# EAGLE design untitled (EAGLE 9.6.2)
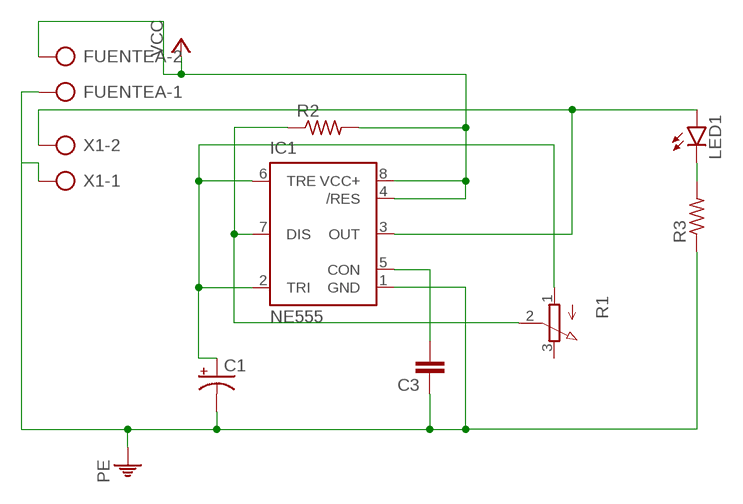
[diagram p0: schematic, sheet 1]

## Parts
C1  CPOL-USE1.8-4  [E1,8-4]
C3  C2,5-3  [C2.5-3]
FUENTEA  AK500/2-H  [AK500/2-H]
IC1  NE555  [DIL-08]
LED1  LED5MM  [LED5MM]
R1  3RP/1610N  [3RP/1610N]
R2  R-US_0204/7  [0204/7]
R3  R-US_0204/7  [0204/7]
X1  AK500/2-H  [AK500/2-H]

## Nets
N$1: IC1.3(OUT) LED1.A X1.2
N$3: C1.+ IC1.2(TRI) IC1.6(TRE) R1.1(A)
N$4: LED1.K(C) R3.2
N$6: C3.2 IC1.5(CON)
N$8: IC1.7(DIS) R1.2(S) R2.1
PE: C1.- C3.1 FUENTEA.1 IC1.1(GND) R3.1 X1.1
VCC: FUENTEA.2 IC1.4(/RES) IC1.8(VCC+) R2.2
Unconnected: R1.3(E)

## Library data of the parts
C1 = rcl:CPOL-US: POLARIZED CAPACITOR, American symbol; SPICEPREFIX: C
C3 = capacitor-wima:C: CAPACITOR naming: grid - package width
FUENTEA X1 = con-ptr500:AK500/2-H: CONNECTOR Aug. 2004 / PTR Meßtechnik: Die Bezeichnung der Serie AK505 wurde geändert. Es handelt sich hierbei um AK500 in horizontaler Ausführung.; OC_FARNELL: unknown; OC_NEWARK: unknown
IC1 = st-microelectronics:NE555: General purpose bipolar Timer; MF: Arrow Electronics; MPN: NE555N; OC_FARNELL: 1467742; OC_NEWARK: 89K1486
LED1 = led:LED: LED OSRAM: - CHIPLED LG R971, LG N971, LY N971, LG Q971, LY Q971, LO R971, LY R971 LH N974, LH R974 LS Q976, LO Q976, LY Q976 LO Q996 - Hyper CHIPLED LW Q18S LB Q993, LB Q99A, LB R99A - SideLED LS A670, LO A670, LY A670, LG A670, LP A670 LB A673, LV A673, LT A673, LW A673 LH A674 LY A675 LS A676, LA A676, LO A676, LY A676, LW A676 LS A679, LY A679, LG A679 - Hyper Micro SIDELED® LS Y876, LA Y876, LO Y876, LY Y876 LT Y87S - SmartLED LW L88C, LW L88S LB L89C, LB L89S, LG L890 LS L89K, LO L89K, LY L89K LS L896, LA L896, LO L896, LY L896 - TOPLED LS T670, LO T670, LY T670, LG T670, LP T670 LSG T670, LSP T670, LSY T670, LOP T670, LYG T670 LG T671, LOG T671, LSG T671 LB T673, LV T673, LT T673, LW T673 LH T674 LS T676, LA T676, LO T676, LY T676, LB T676, LH T676, LSB T676, LW T676 LB T67C, LV T67C, LT T67C, LS T67K, LO T67K, LY T67K, LW E67C LS E67B, LA E67B, LO E67B, LY E67B, LB E67C, LV E67C, LT E67C LW T67C LS T679, LY T679, LG T679 LS T770, LO T770, LY T770, LG T770, LP T770 LB T773, LV T773, LT T773, LW T773 LH T774 LS E675, LA E675, LY E675, LS T675 LS T776, LA T776, LO T776, LY T776, LB T776 LHGB T686 LT T68C, LB T68C - Hyper Mini TOPLED® LB M676 - Mini TOPLED Santana® LG M470 LS M47K, LO M47K, LY M47K Source: http://www.osram.convergy.de LUXEON: - LUMILED® LXK2-PW12-R00, LXK2-PW12-S00, LXK2-PW14-U00, LXK2-PW14-V00 LXK2-PM12-R00, LXK2-PM12-S00, LXK2-PM14-U00 LXK2-PE12-Q00, LXK2-PE12-R00, LXK2-PE12-S00, LXK2-PE14-T00, LXK2-PE14-U00 LXK2-PB12-K00, LXK2-PB12-L00, LXK2-PB12-M00, LXK2-PB14-N00, LXK2-PB14-P00, LXK2-PB14-Q00 LXK2-PR12-L00, LXK2-PR12-M00, LXK2-PR14-Q00, LXK2-PR14-R00 LXK2-PD12-Q00, LXK2-PD12-R00, LXK2-PD12-S00 LXK2-PH12-R00, LXK2-PH12-S00 LXK2-PL12-P00, LXK2-PL12-Q00, LXK2-PL12-R00 Source: www.luxeon.com KINGBRIGHT: KA-3528ASYC Source: www.kingbright.com
R1 = pot:3RP/1610N: 16mm Potentiometer one level Source: http://www.alphapotentiometers.net/html/16mm_pot_2.html
R2 R3 = rcl:R-US_: RESISTOR, American symbol; SPICEPREFIX: R

## Board
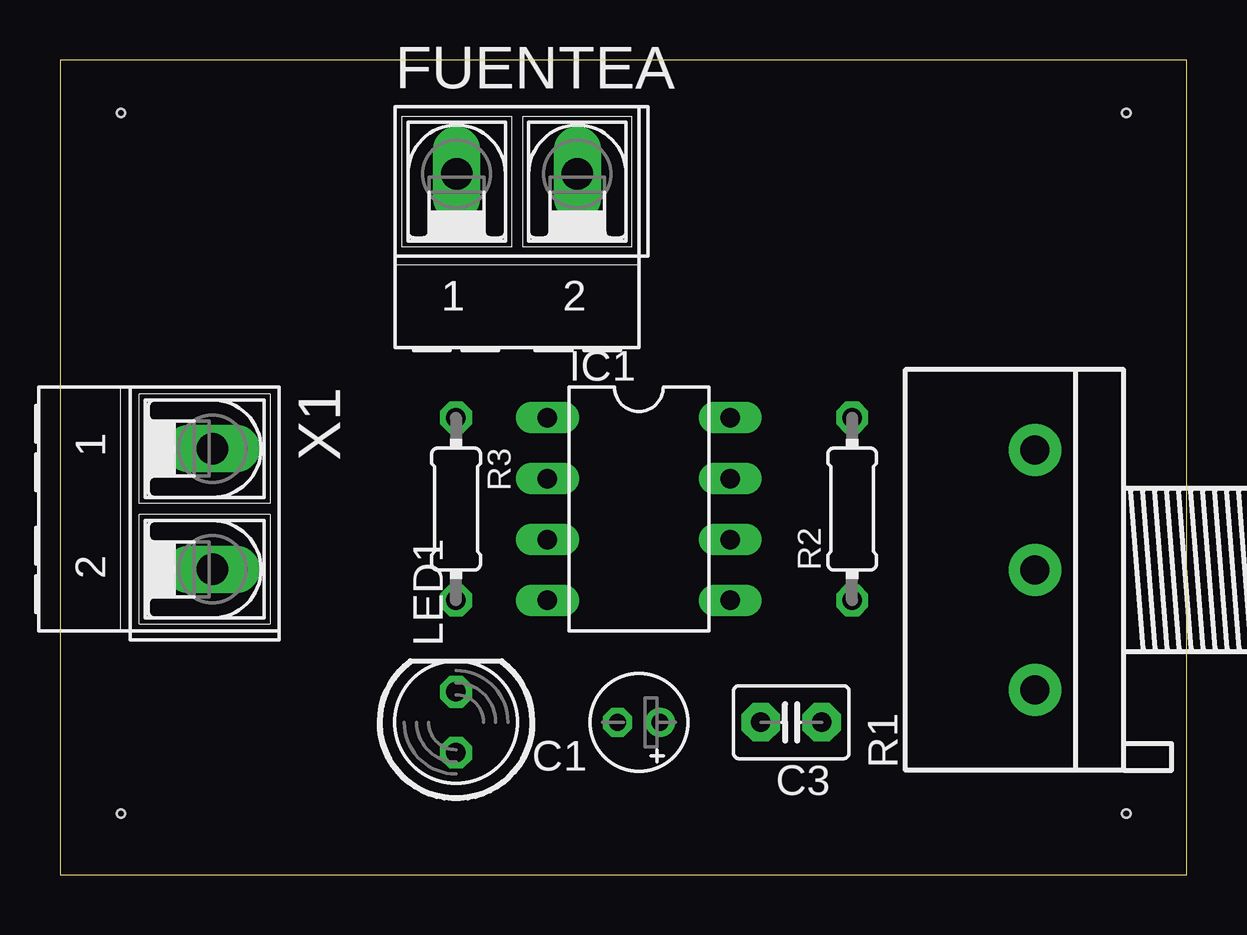
[diagram p1: board, top side]
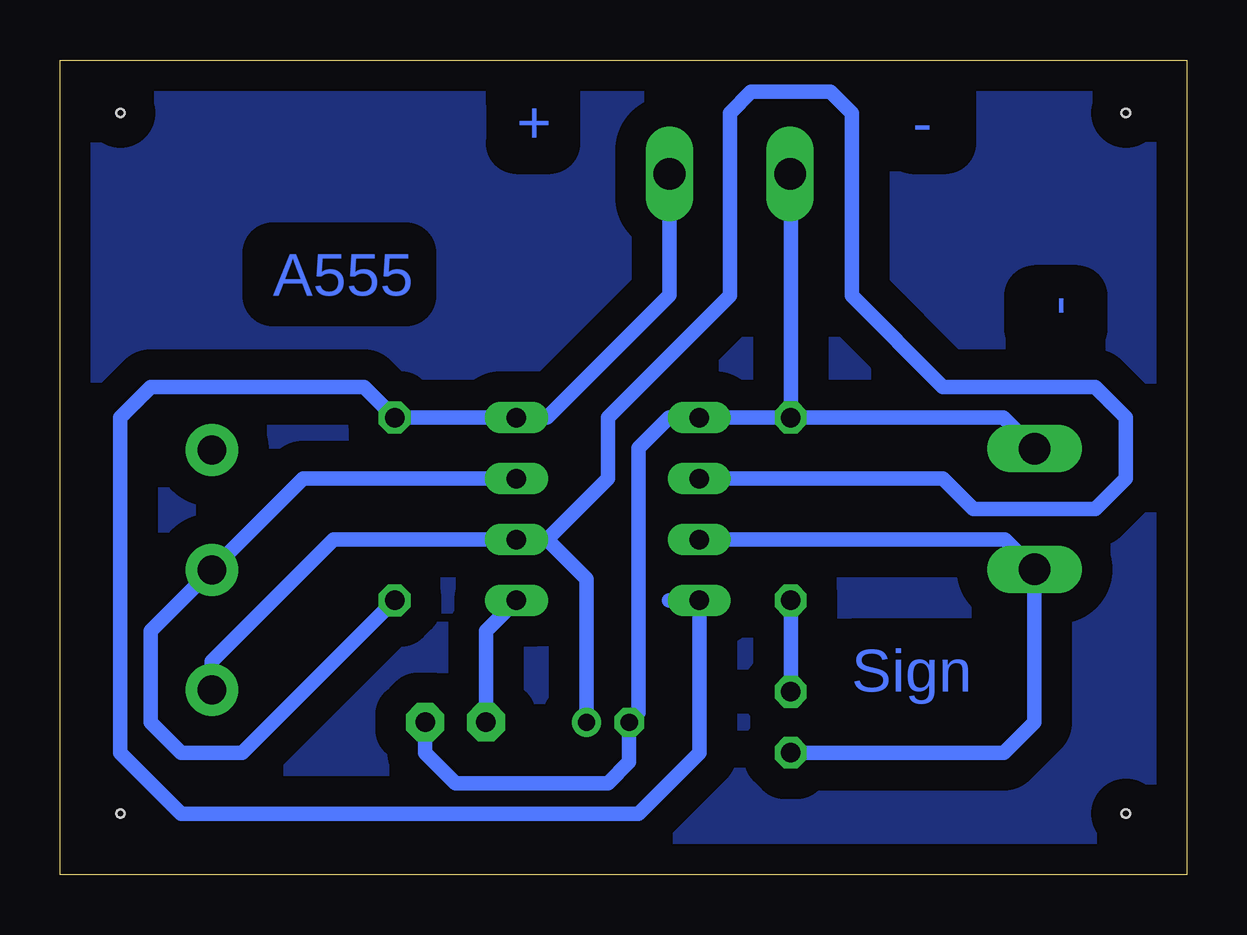
[diagram p2: board, bottom side, seen from below]

Size 46.97 x 33.96 mm. Coordinates in mm from the lower left corner, seen from the top.
Outline: 0,0 46.97,0 46.97,33.96 0,33.96 0,0
Copper layers (1*16): Top 0.035mm / dielectric 1.5mm / Bottom 0.035mm
Design rules "default": minimum track width 6mil, minimum drill 0.35mm, track to track 6mil, track to pad 6mil, pad to pad 6mil, via to via 6mil, smd to smd 6mil, copper to edge 40mil, drill to drill 6mil, minimum pad ring 10mil, minimum via ring 8mil, stop-mask expansion 4mil, vias tented up to drill 0mil, thermal gap 10mil
Holes 0.35 mm at 2.54,31.75 2.54,2.54 44.45,2.54 44.45,31.75

### Footprints (pad centres in the part's own frame; a part is rotated, then mirrored left to right if it is on the bottom)
E1,8-4 = drill 0.711 pad 1.168: + -0.889,0 | drill 0.711 pad 1.168 octagon: - 0.889,0
C2.5-3 = drill 0.813 pad 1.6 octagon: 1 -1.27,0; 2 1.27,0
AK500/2-H = drill 1.321 long: 1 -2.515,0; 2 2.515,0
DIL-08 = drill 0.813 long: 1 -3.81,-3.81; 2 -1.27,-3.81; 3 1.27,-3.81; 4 3.81,-3.81; 5 3.81,3.81; 6 1.27,3.81; 7 -1.27,3.81; 8 -3.81,3.81
LED5MM = drill 0.813 octagon: A -1.27,0; K 1.27,0
3RP/1610N = drill 1.2 pad 2.184: 1 -5,0; 2 0,0; 3 5,0
0204/7 = drill 0.813 octagon: 1 -3.81,0; 2 3.81,0

### Placement (x,y rotation side)
C1  24.13,6.35 180 top
C3  30.48,6.35 180 top
FUENTEA  19.05,29.21 0 top
IC1  24.13,15.24 270 top
LED1  16.51,6.35 90 top
R1  40.64,12.7 90 top
R2  33.02,15.24 90 top
R3  16.51,15.24 270 top
X1  6.35,15.24 270 top

### Tracks (layer width: path | path; a pad name or v marks a point on that pad's centre or on a via)
F
  pour Bottom (isolate 1.27): 0,34.29 0,0 46.99,0 46.99,34.29
N$1
  Bottom 0.61: 19.05,13.97 IC1.3 7.59,13.97 X1.2 6.35,6.35 7.62,5.08 LED1.A
N$3
  Bottom 0.61: R1.1 40.64,8.89 35.56,13.97 IC1.6 26.67,13.97 | C1.+ 25.02,12.32 26.67,13.97 | 26.67,13.97 24.13,16.51 24.13,19.05 19.05,24.13 19.05,31.75 18.16,32.64 14.86,32.64 13.97,31.75 13.97,24.13 10.16,20.32 3.81,20.32 2.54,19.05 2.54,16.51 3.81,15.24 8.89,15.24 10.16,16.51 IC1.2
N$4
  Bottom 0.61: R3.2 LED1.K
N$6
  Bottom 0.61: IC1.5 29.21,10.16 C3.2
N$8
  Bottom 0.61: IC1.7 36.83,16.51 R1.2 43.18,10.16 43.18,6.35 41.91,5.08 39.37,5.08 R2.1
PE
  Bottom 0.61: R3.1 IC1.1 21.59,19.05 22.86,17.78 22.86,6.73 C1.- 23.24,4.7 24.13,3.81 30.48,3.81 31.75,5.08 C3.1 | R3.1 16.51,29.18 FUENTEA.1 | X1.1 7.65,19.05 R3.1
VCC
  Bottom 0.61: FUENTEA.2 21.57,24.16 26.67,19.05 IC1.8 R2.2 34.29,20.32 43.18,20.32 44.45,19.05 44.45,5.08 41.91,2.54 22.86,2.54 20.32,5.08 IC1.4 21.59,11.43

### Text on the board
Bottom: - | + | - | A555 | Sign